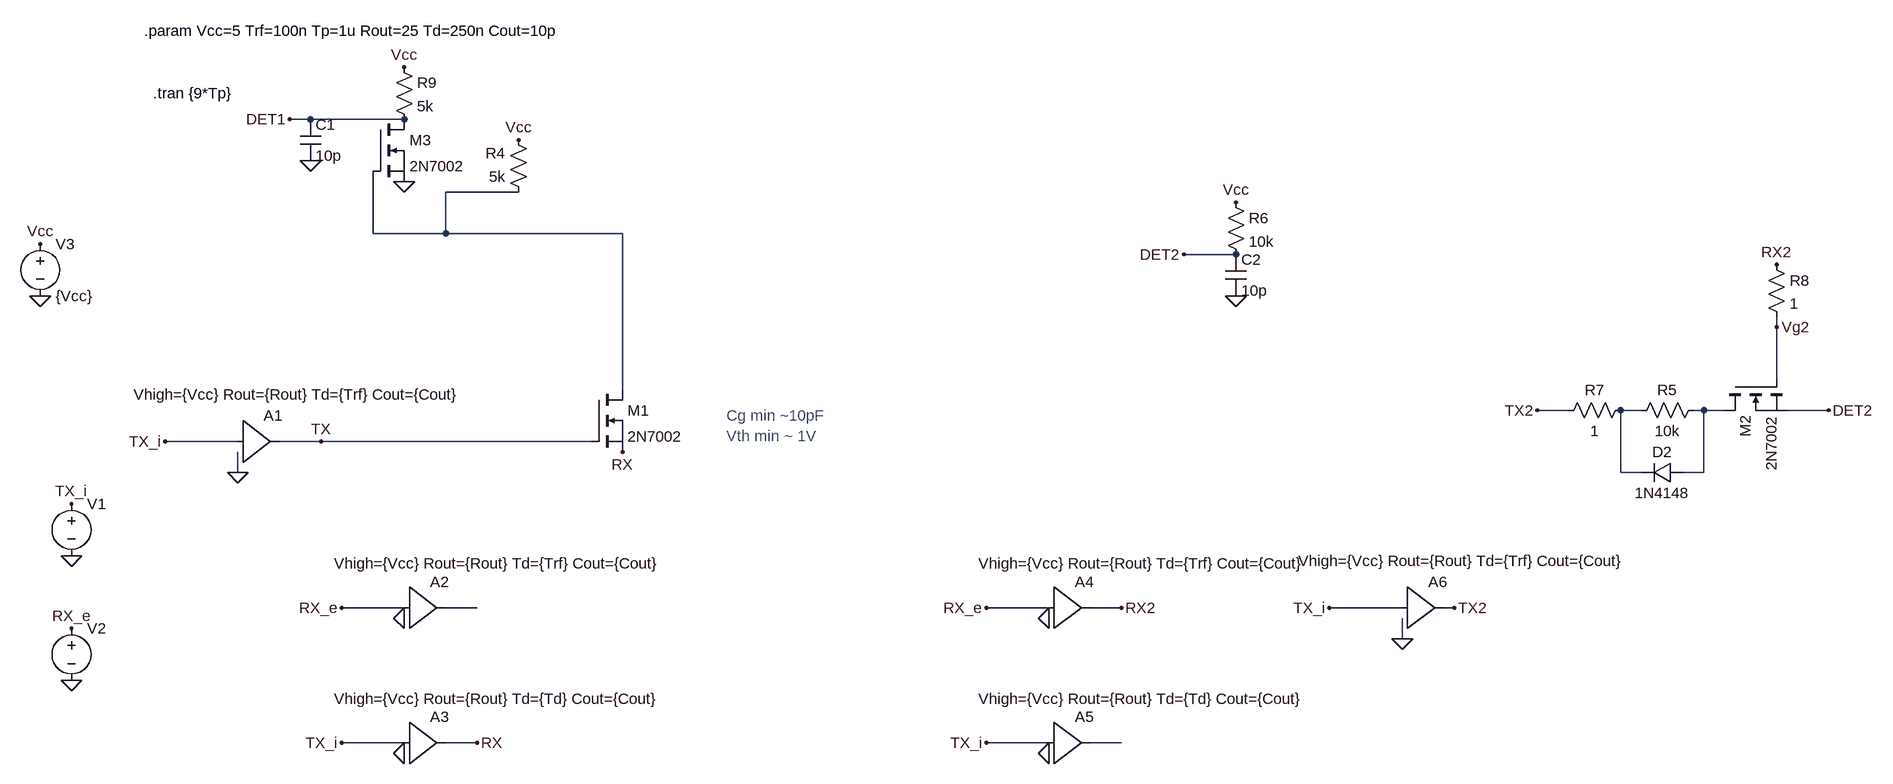
[diagram p0: schematic collision_mos.asc]
collision_mos.asc, the LTspice schematic file:
Version 4
SHEET 1 2144 732
WIRE -272 -288 -304 -288
WIRE -128 -288 -272 -288
WIRE 48 -176 -64 -176
WIRE -176 -112 -176 -208
WIRE -64 -112 -64 -176
WIRE -64 -112 -176 -112
WIRE 208 -112 -64 -112
WIRE 1152 -80 1072 -80
WIRE 1984 32 1984 16
WIRE 1984 112 1984 32
WIRE 208 128 208 -112
WIRE 1664 160 1616 160
WIRE 1776 160 1744 160
WIRE 1872 160 1856 160
WIRE 1904 160 1872 160
WIRE 2064 160 2000 160
WIRE -384 208 -496 208
WIRE -256 208 -320 208
WIRE 160 208 -256 208
WIRE -384 256 -384 224
WIRE 1744 256 1744 160
WIRE 1776 256 1744 256
WIRE 1872 256 1872 160
WIRE 1872 256 1840 256
WIRE -128 464 -224 464
WIRE -16 464 -64 464
WIRE 864 464 768 464
WIRE 976 464 928 464
WIRE 1408 464 1296 464
WIRE 1488 464 1472 464
WIRE 1408 512 1408 480
WIRE -128 672 -224 672
WIRE -16 672 -64 672
WIRE 864 672 768 672
WIRE 976 672 928 672
FLAG -384 256 0
FLAG -496 208 TX_i
FLAG -640 384 0
FLAG -640 304 TX_i
FLAG -256 208 TX
FLAG -640 576 0
FLAG -640 496 RX_e
FLAG -128 480 0
FLAG -224 464 RX_e
FLAG -16 672 RX
FLAG -304 -288 DET1
FLAG -688 -16 0
FLAG -688 -96 Vcc
FLAG 48 -256 Vcc
FLAG -272 -224 0
FLAG 208 224 RX
FLAG -128 688 0
FLAG -224 672 TX_i
FLAG 1984 32 Vg2
FLAG 1072 -80 DET2
FLAG 1152 -16 0
FLAG 1984 -64 RX2
FLAG 2064 160 DET2
FLAG 864 480 0
FLAG 768 464 RX_e
FLAG 976 464 RX2
FLAG 864 688 0
FLAG 768 672 TX_i
FLAG 1408 512 0
FLAG 1296 464 TX_i
FLAG 1488 464 TX2
FLAG 1616 160 TX2
FLAG 1152 -160 Vcc
FLAG -128 -368 Vcc
FLAG -128 -192 0
SYMBOL nmos 160 128 R0
SYMATTR InstName M1
SYMATTR Value 2N7002
SYMBOL Digital\\buf1 -384 144 R0
WINDOW 123 -160 -8 Left 2
SYMATTR InstName A1
SYMATTR Value2 Vhigh={Vcc} Rout={Rout} Td={Trf} Cout={Cout}
SYMBOL voltage -640 288 R0
WINDOW 3 24 96 Invisible 2
WINDOW 123 0 0 Left 0
WINDOW 39 0 0 Left 0
SYMATTR InstName V1
SYMATTR Value PWL(0 0 {Tp} 0 {Tp+Trf} {Vcc} {4*Tp} {Vcc} {Trf+4*Tp} 0 {6*Tp} 0 {Trf+6*Tp} {Vcc} {7*Tp} {Vcc} {Trf+7*Tp} 0)
SYMBOL voltage -640 480 R0
WINDOW 3 24 96 Invisible 2
WINDOW 123 0 0 Left 0
WINDOW 39 0 0 Left 0
SYMATTR InstName V2
SYMATTR Value PWL(0 0 {2*Tp} 0 {Trf+2*Tp} {Vcc} {3*Tp} {Vcc} {Trf+3*Tp} 0 {5*Tp} 0 {Trf+5*Tp} {Vcc} {8*Tp} {Vcc} {Trf+8*Tp} 0)
SYMBOL Digital\\buf1 -128 400 R0
WINDOW 123 -108 -4 Left 2
SYMATTR InstName A2
SYMATTR Value2 Vhigh={Vcc} Rout={Rout} Td={Trf} Cout={Cout}
SYMBOL cap -288 -288 R0
SYMATTR InstName C1
SYMATTR Value 10p
SYMBOL voltage -688 -112 R0
SYMATTR InstName V3
SYMATTR Value {Vcc}
SYMBOL Digital\\buf1 -128 608 R0
WINDOW 123 -108 -4 Left 2
SYMATTR InstName A3
SYMATTR Value2 Vhigh={Vcc} Rout={Rout} Td={Td} Cout={Cout}
SYMBOL res 64 -160 R180
WINDOW 0 36 76 Left 2
WINDOW 3 36 40 Left 2
SYMATTR InstName R4
SYMATTR Value 5k
SYMBOL nmos 1904 112 M90
SYMATTR InstName M2
SYMATTR Value 2N7002
SYMBOL res 1872 144 R90
WINDOW 0 0 56 VBottom 2
WINDOW 3 32 56 VTop 2
SYMATTR InstName R5
SYMATTR Value 10k
SYMBOL cap 1136 -80 R0
SYMATTR InstName C2
SYMATTR Value 10p
SYMBOL res 1136 -176 R0
SYMATTR InstName R6
SYMATTR Value 10k
SYMBOL diode 1840 240 R90
WINDOW 0 0 32 VBottom 2
WINDOW 3 32 32 VTop 2
SYMATTR InstName D2
SYMATTR Value 1N4148
SYMBOL res 1760 144 R90
WINDOW 0 0 56 VBottom 2
WINDOW 3 32 56 VTop 2
SYMATTR InstName R7
SYMATTR Value 1
SYMBOL res 1968 -80 R0
SYMATTR InstName R8
SYMATTR Value 1
SYMBOL Digital\\buf1 864 400 R0
WINDOW 123 -108 -4 Left 2
SYMATTR InstName A4
SYMATTR Value2 Vhigh={Vcc} Rout={Rout} Td={Trf} Cout={Cout}
SYMBOL Digital\\buf1 864 608 R0
WINDOW 123 -108 -4 Left 2
SYMATTR InstName A5
SYMATTR Value2 Vhigh={Vcc} Rout={Rout} Td={Td} Cout={Cout}
SYMBOL Digital\\buf1 1408 400 R0
WINDOW 123 -160 -8 Left 2
SYMATTR InstName A6
SYMATTR Value2 Vhigh={Vcc} Rout={Rout} Td={Trf} Cout={Cout}
SYMBOL nmos -176 -288 R0
SYMATTR InstName M3
SYMATTR Value 2N7002
SYMBOL res -144 -384 R0
SYMATTR InstName R9
SYMATTR Value 5k
TEXT -528 -424 Left 2 !.param Vcc=5 Trf=100n Tp=1u Rout=25 Td=250n Cout=10p
TEXT 368 168 Left 2 ;Cg min ~10pF\nVth min ~ 1V
TEXT -514 -328 Left 2 !.tran {9*Tp}

The netlist it stands for:
* collision_mos.asc
M1 N001 TX RX RX 2N7002
A1 TX_i 0 0 0 0 0 TX 0 BUF Vhigh={Vcc} Rout={Rout} Td={Trf} Cout={Cout}
V1 TX_i 0 PWL(0 0 {Tp} 0 {Tp+Trf} {Vcc} {4*Tp} {Vcc} {Trf+4*Tp} 0 {6*Tp} 0 {Trf+6*Tp} {Vcc} {7*Tp} {Vcc} {Trf+7*Tp} 0)
V2 RX_e 0 PWL(0 0 {2*Tp} 0 {Trf+2*Tp} {Vcc} {3*Tp} {Vcc} {Trf+3*Tp} 0 {5*Tp} 0 {Trf+5*Tp} {Vcc} {8*Tp} {Vcc} {Trf+8*Tp} 0)
A2 RX_e 0 0 0 0 0 N004 0 BUF Vhigh={Vcc} Rout={Rout} Td={Trf} Cout={Cout}
C1 DET1 0 10p
V3 Vcc 0 {Vcc}
A3 TX_i 0 0 0 0 0 RX 0 BUF Vhigh={Vcc} Rout={Rout} Td={Td} Cout={Cout}
R4 N001 Vcc 5k
M2 N003 Vg2 DET2 DET2 2N7002
R5 N003 N002 10k
C2 DET2 0 10p
R6 Vcc DET2 10k
D2 N003 N002 1N4148
R7 N002 TX2 1
R8 RX2 Vg2 1
A4 RX_e 0 0 0 0 0 RX2 0 BUF Vhigh={Vcc} Rout={Rout} Td={Trf} Cout={Cout}
A5 TX_i 0 0 0 0 0 N005 0 BUF Vhigh={Vcc} Rout={Rout} Td={Td} Cout={Cout}
A6 TX_i 0 0 0 0 0 TX2 0 BUF Vhigh={Vcc} Rout={Rout} Td={Trf} Cout={Cout}
M3 DET1 N001 0 0 2N7002
R9 Vcc DET1 5k
.model D D
.lib standard.dio
.model NMOS NMOS
.model PMOS PMOS
.lib standard.mos
.param Vcc=5 Trf=100n Tp=1u Rout=25 Td=250n Cout=10p
* Cg min ~10pF
* Vth min ~ 1V
.tran {9*Tp}
.backanno
.end